# Altium schematic sheet TYPEC.SchDoc
size A4; SheetNumber: 3; SheetTotal: 26
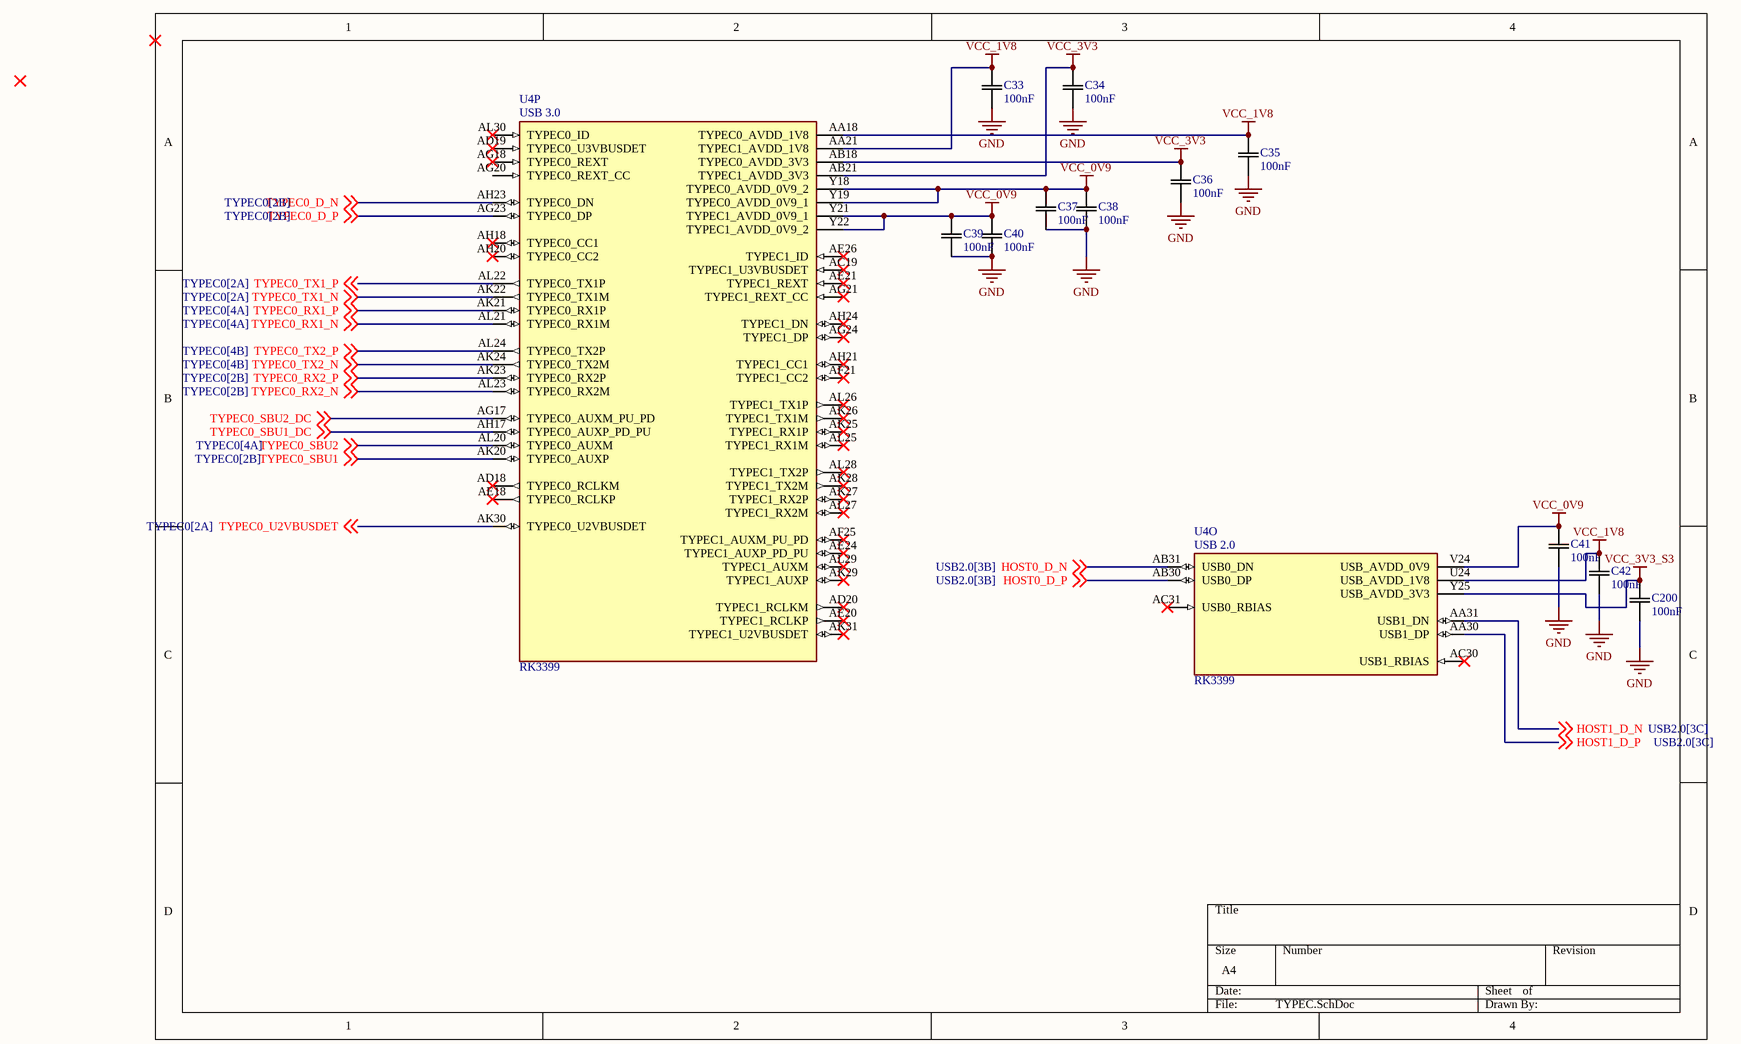
[diagram p0: TYPEC.SchDoc]

## Parts
C33  100nF  [CAP_1005_TDK]
C34  100nF  [CAP_1005_TDK]
C35  100nF  [CAP_1005_TDK]
C36  100nF  [CAP_1005_TDK]
C37  100nF  [CAP_1005_TDK]
C38  100nF  [CAP_1005_TDK]
C39  100nF  [CAP_1005_TDK]
C40  100nF  [CAP_1005_TDK]
C41  100nF  [CAP_1005_TDK]
C42  100nF  [CAP_1005_TDK]
C200  100nF  [CAP_1005_TDK]
U4  RK3399  [BGA828C65P31X31_2100X2100X161N]  (parts O,P of 32)

## Nets
GND: C33.2 C34.2 C35.2 C36.2 C37.2 C38.2 C39.2 C40.2 C41.2 C42.2 C200.2
VCC_0V9: C37.1 C38.1 C39.1 C40.1 C41.1 U4.V24(USB_AVDD_0V9) U4.Y18(TYPEC0_AVDD_0V9_2) U4.Y19(TYPEC0_AVDD_0V9_1) U4.Y21(TYPEC1_AVDD_0V9_1) U4.Y22(TYPEC1_AVDD_0V9_2)
VCC_1V8: C33.1 C35.1 C42.1 U4.AA18(TYPEC0_AVDD_1V8) U4.AA21(TYPEC1_AVDD_1V8) U4.U24(USB_AVDD_1V8)
VCC_3V3: C34.1 C36.1 U4.AB18(TYPEC0_AVDD_3V3) U4.AB21(TYPEC1_AVDD_3V3)
VCC_3V3_S3: C200.1 U4.Y25(USB_AVDD_3V3)
HOST0_D_N: U4.AB31(USB0_DN) ; off-sheet HOST0_D_N
HOST0_D_P: U4.AB30(USB0_DP) ; off-sheet HOST0_D_P
HOST1_D_N: U4.AA31(USB1_DN) ; off-sheet HOST1_D_N
HOST1_D_P: U4.AA30(USB1_DP) ; off-sheet HOST1_D_P
TYPEC0_D_N: U4.AH23(TYPEC0_DN) ; off-sheet TYPEC0_D_N
TYPEC0_D_P: U4.AG23(TYPEC0_DP) ; off-sheet TYPEC0_D_P
TYPEC0_RX1_N: U4.AL21(TYPEC0_RX1M) ; off-sheet TYPEC0_RX1_N
TYPEC0_RX1_P: U4.AK21(TYPEC0_RX1P) ; off-sheet TYPEC0_RX1_P
TYPEC0_RX2_N: U4.AL23(TYPEC0_RX2M) ; off-sheet TYPEC0_RX2_N
TYPEC0_RX2_P: U4.AK23(TYPEC0_RX2P) ; off-sheet TYPEC0_RX2_P
TYPEC0_SBU1: U4.AK20(TYPEC0_AUXP) ; off-sheet TYPEC0_SBU1
TYPEC0_SBU1_DC: U4.AH17(TYPEC0_AUXP_PD_PU) ; off-sheet TYPEC0_SBU1_DC
TYPEC0_SBU2: U4.AL20(TYPEC0_AUXM) ; off-sheet TYPEC0_SBU2
TYPEC0_SBU2_DC: U4.AG17(TYPEC0_AUXM_PU_PD) ; off-sheet TYPEC0_SBU2_DC
TYPEC0_TX1_N: U4.AK22(TYPEC0_TX1M) ; off-sheet TYPEC0_TX1_N
TYPEC0_TX1_P: U4.AL22(TYPEC0_TX1P) ; off-sheet TYPEC0_TX1_P
TYPEC0_TX2_N: U4.AK24(TYPEC0_TX2M) ; off-sheet TYPEC0_TX2_N
TYPEC0_TX2_P: U4.AL24(TYPEC0_TX2P) ; off-sheet TYPEC0_TX2_P
TYPEC0_U2VBUSDET: U4.AK30(TYPEC0_U2VBUSDET) ; off-sheet TYPEC0_U2VBUSDET

Not connected (* = marked no-connect by the designer): U4 AC19(TYPEC1_U3VBUSDET)* AC30(USB1_RBIAS)* AC31(USB0_RBIAS)* AD18(TYPEC0_RCLKM)* AD19(TYPEC0_U3VBUSDET)* AD20(TYPEC1_RCLKM)* AE18(TYPEC0_RCLKP)* AE20(TYPEC1_RCLKP)* AE21(TYPEC1_REXT)* AE24(TYPEC1_AUXP_PD_PU)* AE26(TYPEC1_ID)* AF21(TYPEC1_CC2)* AF25(TYPEC1_AUXM_PU_PD)* AG18(TYPEC0_REXT)* AG20(TYPEC0_REXT_CC) AG21(TYPEC1_REXT_CC)* AG24(TYPEC1_DP)* AH18(TYPEC0_CC1)* AH20(TYPEC0_CC2)* AH21(TYPEC1_CC1)* AH24(TYPEC1_DN)* AK25(TYPEC1_RX1P)* AK26(TYPEC1_TX1M)* AK27(TYPEC1_RX2P)* AK28(TYPEC1_TX2M)* AK29(TYPEC1_AUXP)* AK31(TYPEC1_U2VBUSDET)* AL25(TYPEC1_RX1M)* AL26(TYPEC1_TX1P)* AL27(TYPEC1_RX2M)* AL28(TYPEC1_TX2P)* AL29(TYPEC1_AUXM)* AL30(TYPEC0_ID)*

## Notes on the sheet
- (in symbol RK3399, part O) USB 2.0
- (in symbol RK3399, part P) USB 3.0

## Library data of the parts
C33-C42 C200 = C1005X7R1H104M050BB: Description; Manufacturer_Name: TDK; Copyright: Copyright (C) 2025 Ultra Librarian. All rights reserved.; Manufacturer_Part_Number: C1005X7R1H104M050BB
U4 = RK3399: RK3399 ROCK Pi 4 Model A 2GB - ARMÂ® CortexÂ®-A53, CortexÂ®-A72 MPU Embedded Evaluation Board; MF: Rockchip; SnapEDA_Link: https://www.snapeda.com/parts/RK3399/Fuzhou+Rockchip+Electronics+Co/view-part/?ref=snap; Package: Seeed Technology; MP: RK3399; Check_prices: https://www.snapeda.com/parts/RK3399/Fuzhou+Rockchip+Electronics+Co/view-part/?ref=eda; Price: None; Value: *; Availability: Not in stock